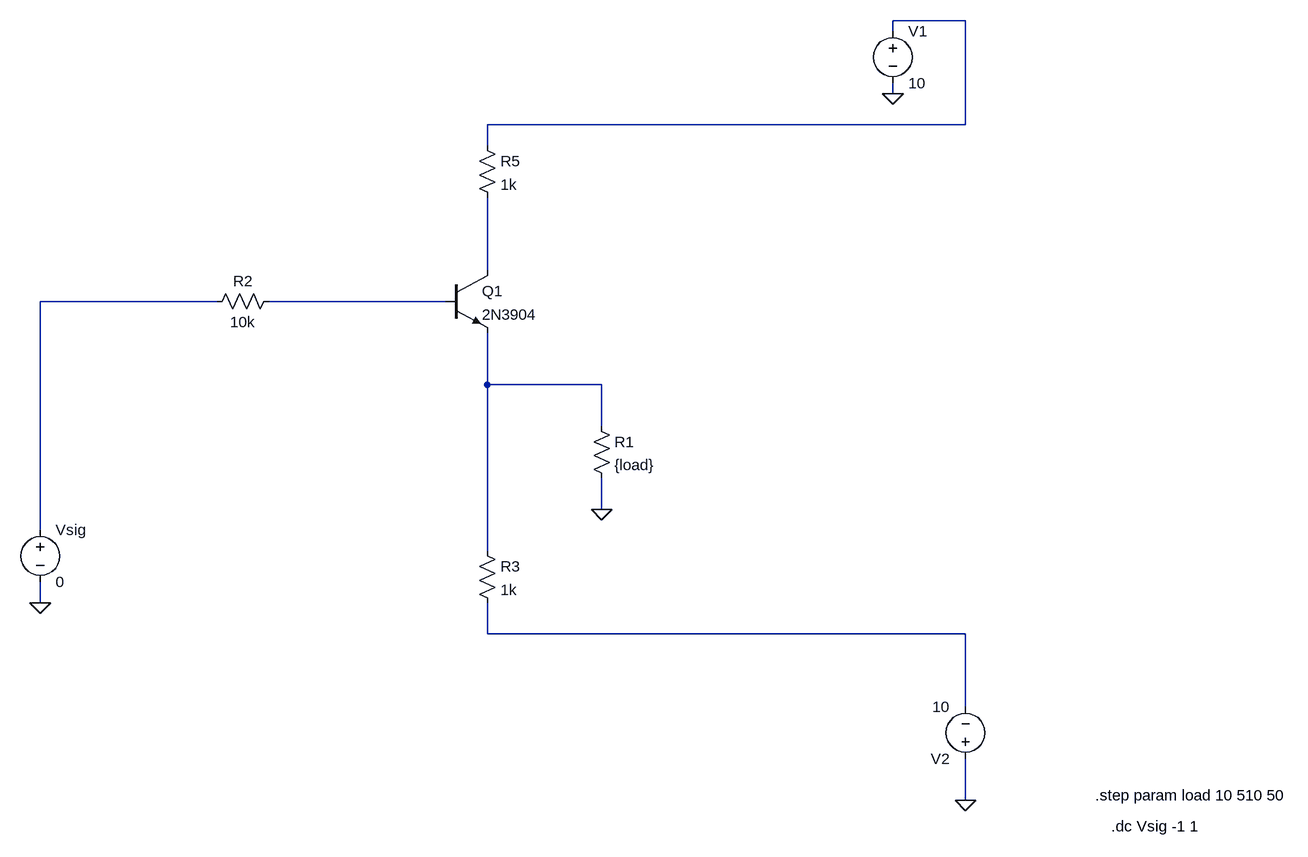
[diagram p0: schematic Emitter Follower.asc]
Emitter Follower.asc, the LTspice schematic file:
Version 4
SHEET 1 1272 864
WIRE 672 -512 560 -512
WIRE 560 -496 560 -512
WIRE 560 -400 560 -416
WIRE 672 -352 672 -512
WIRE 672 -352 -64 -352
WIRE -64 -320 -64 -352
WIRE -64 -128 -64 -240
WIRE -480 -80 -752 -80
WIRE -128 -80 -400 -80
WIRE -64 48 -64 -32
WIRE 112 48 -64 48
WIRE 112 112 112 48
WIRE 112 240 112 192
WIRE -752 272 -752 -80
WIRE -64 304 -64 48
WIRE -752 384 -752 352
WIRE -64 432 -64 384
WIRE 672 432 -64 432
WIRE 672 544 672 432
WIRE 672 688 672 624
FLAG 560 -400 0
FLAG 672 688 0
FLAG -752 384 0
FLAG 112 240 0
SYMBOL voltage 560 -512 R0
WINDOW 123 0 0 Left 2
WINDOW 39 0 0 Left 2
SYMATTR InstName V1
SYMATTR Value 10
SYMBOL voltage 672 640 R180
WINDOW 123 0 0 Left 2
WINDOW 39 0 0 Left 2
SYMATTR InstName V2
SYMATTR Value 10
SYMBOL npn -128 -128 R0
SYMATTR InstName Q1
SYMATTR Value 2N3904
SYMBOL res -80 288 R0
SYMATTR InstName R3
SYMATTR Value 1k
SYMBOL voltage -752 256 R0
WINDOW 123 0 0 Left 2
WINDOW 39 0 0 Left 2
SYMATTR InstName Vsig
SYMATTR Value 0
SYMBOL res -80 -336 R0
SYMATTR InstName R5
SYMATTR Value 1k
SYMBOL res 96 96 R0
SYMATTR InstName R1
SYMATTR Value {load}
SYMBOL res -496 -64 R270
WINDOW 0 32 56 VTop 2
WINDOW 3 0 56 VBottom 2
SYMATTR InstName R2
SYMATTR Value 10k
TEXT 896 728 Left 2 !.dc Vsig -1 1 
TEXT 872 680 Left 2 !.step param load 10 510 50

The netlist it stands for:
* Emitter Follower.asc
V1 N001 0 10
V2 0 N006 10
Q1 N002 N004 N005 0 2N3904
R3 N005 N006 1k
Vsig N003 0 0
R5 N001 N002 1k
R1 N005 0 {load}
R2 N003 N004 10k
.model NPN NPN
.model PNP PNP
.lib standard.bjt
.dc Vsig -1 1
.step param load 10 510 50
.backanno
.end